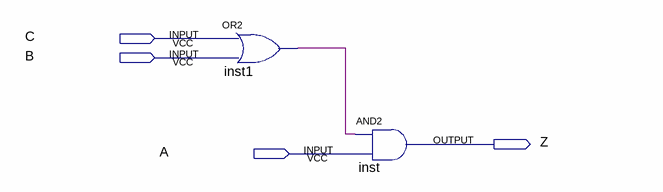
[diagram p0: schematic sheet]
// Quartus schematic task2.bdf as structural Verilog: 2 symbols, 4 pins
module task2 (
  input  C,
  input  B,
  input  A,
  output Z
);

  wire inst1_out;

  or inst1 (inst1_out, C, B);
  and inst (Z, inst1_out, A);
endmodule
